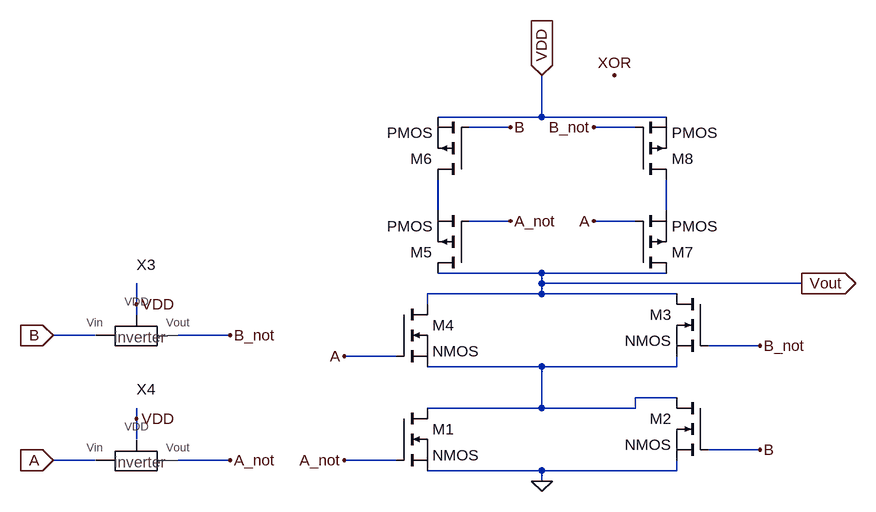
[diagram p0: schematic xor.asc]
xor.asc, the LTspice schematic file:
Version 4
SHEET 1 880 680
WIRE 352 -576 352 -640
WIRE 352 -576 192 -576
WIRE 544 -576 352 -576
WIRE 304 -560 240 -560
WIRE 496 -560 432 -560
WIRE 192 -432 192 -480
WIRE 544 -432 544 -480
WIRE 304 -416 240 -416
WIRE 496 -416 432 -416
WIRE 352 -336 192 -336
WIRE 544 -336 352 -336
WIRE 352 -320 352 -336
WIRE 752 -320 352 -320
WIRE 352 -304 352 -320
WIRE 352 -304 176 -304
WIRE 560 -304 352 -304
WIRE -272 -288 -272 -320
WIRE 176 -288 176 -304
WIRE -272 -272 -272 -288
WIRE -336 -240 -400 -240
WIRE -128 -240 -208 -240
WIRE 688 -224 608 -224
WIRE 128 -208 48 -208
WIRE 352 -192 176 -192
WIRE 560 -192 560 -208
WIRE 560 -192 352 -192
WIRE 560 -144 496 -144
WIRE 352 -128 352 -192
WIRE 352 -128 176 -128
WIRE 496 -128 496 -144
WIRE 496 -128 352 -128
WIRE -272 -112 -272 -128
WIRE -272 -80 -272 -112
WIRE 688 -64 608 -64
WIRE -336 -48 -400 -48
WIRE -128 -48 -208 -48
WIRE 128 -48 48 -48
WIRE 352 -32 176 -32
WIRE 560 -32 560 -48
WIRE 560 -32 352 -32
WIRE 352 -16 352 -32
FLAG 464 -640 XOR
FLAG 352 -16 0
FLAG 432 -560 B_not
FLAG 688 -224 B_not
FLAG 304 -560 B
FLAG 688 -64 B
FLAG 48 -208 A
FLAG 432 -416 A
FLAG 304 -416 A_not
FLAG 48 -48 A_not
FLAG 752 -320 Vout
IOPIN 752 -320 Out
FLAG 352 -640 VDD
IOPIN 352 -640 In
FLAG -400 -240 B
IOPIN -400 -240 In
FLAG -128 -240 B_not
FLAG -400 -48 A
IOPIN -400 -48 In
FLAG -128 -48 A_not
FLAG -272 -288 VDD
FLAG -272 -112 VDD
SYMBOL nmos 128 -128 R0
SYMATTR InstName M1
SYMBOL nmos 608 -144 M0
SYMATTR InstName M2
SYMBOL nmos 608 -304 M0
SYMATTR InstName M3
SYMBOL nmos 128 -288 R0
SYMATTR InstName M4
SYMBOL pmos 240 -336 R180
SYMATTR InstName M5
SYMBOL pmos 240 -480 R180
SYMATTR InstName M6
SYMBOL pmos 496 -336 M180
SYMATTR InstName M7
SYMBOL pmos 496 -480 M180
SYMATTR InstName M8
SYMBOL Inverter -240 -224 R0
SYMATTR InstName X3
SYMBOL Inverter -240 -32 R0
SYMATTR InstName X4

The netlist it stands for:
* xor.asc
M1 N003 A_not 0 0 NMOS
M2 N003 B 0 0 NMOS
M3 Vout B_not N003 N003 NMOS
M4 Vout A N003 N003 NMOS
M5 Vout A_not N001 N001 PMOS
M6 N001 B VDD VDD PMOS
M7 Vout A N002 N002 PMOS
M8 N002 B_not VDD VDD PMOS
XX3 B VDD B_not Inverter  ; pins Vin VDD Vout
XX4 A VDD A_not Inverter  ; pins Vin VDD Vout
.model NMOS NMOS
.model PMOS PMOS
.lib standard.mos
.backanno
.end